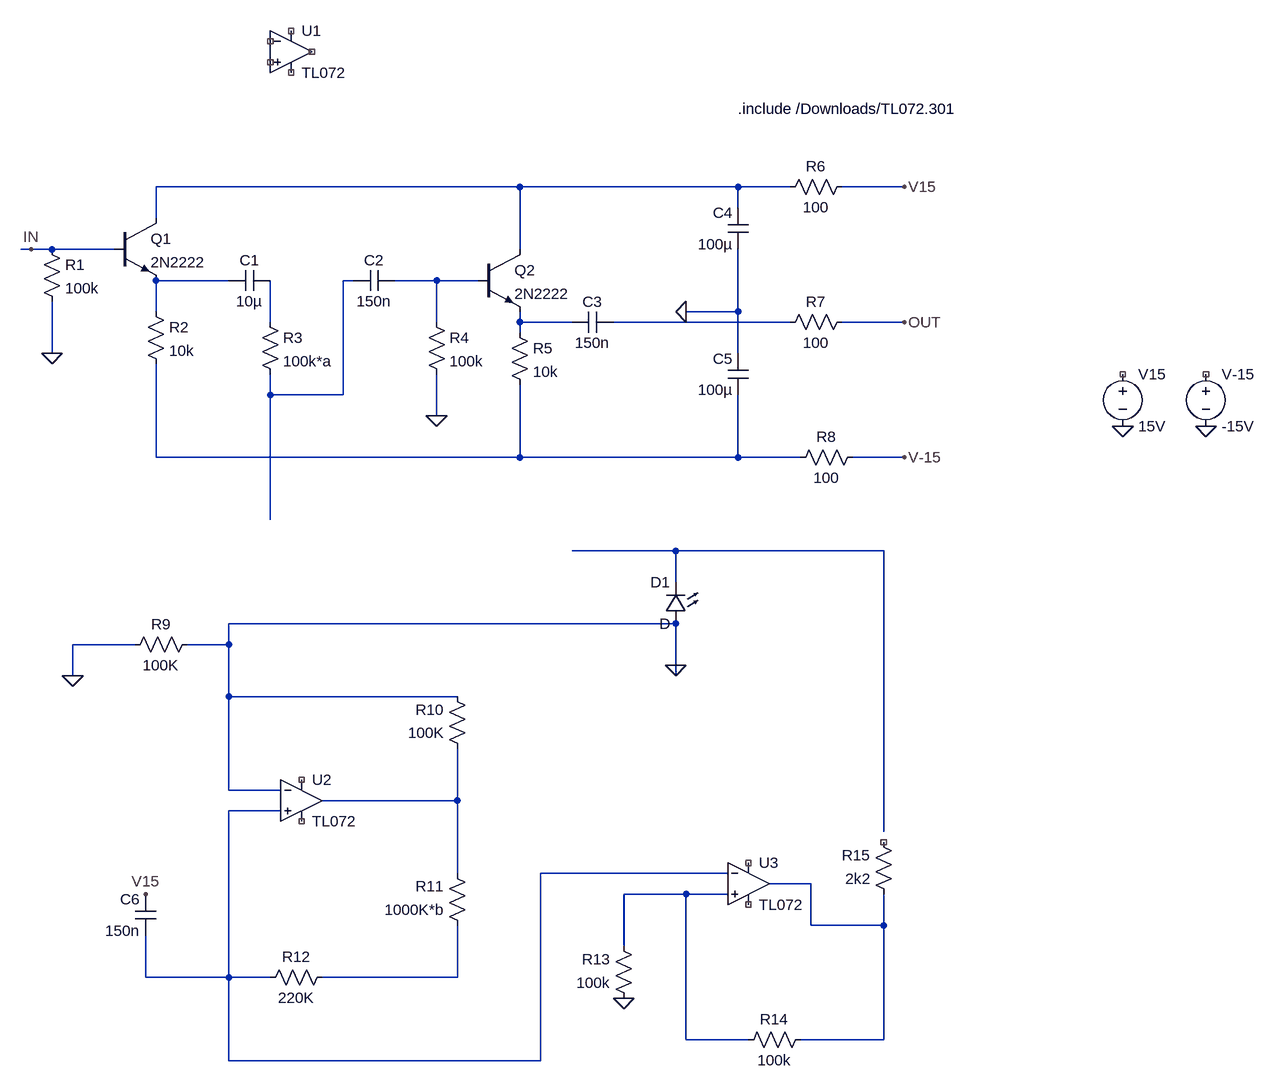
[diagram p0: schematic AM.asc]
AM.asc, the LTspice schematic file:
Version 4
SHEET 1 1952 1544
WIRE 816 192 256 192
WIRE 1152 192 816 192
WIRE 1232 192 1152 192
WIRE 1408 192 1312 192
WIRE 1152 224 1152 192
WIRE 256 240 256 192
WIRE 64 288 48 288
WIRE 96 288 64 288
WIRE 192 288 96 288
WIRE 816 288 816 192
WIRE 368 336 256 336
WIRE 560 336 544 336
WIRE 688 336 624 336
WIRE 752 336 688 336
WIRE 256 384 256 336
WIRE 1152 384 1152 288
WIRE 1152 384 1072 384
WIRE 432 400 432 336
WIRE 688 400 688 336
WIRE 816 400 816 384
WIRE 896 400 816 400
WIRE 1232 400 960 400
WIRE 1408 400 1312 400
WIRE 816 416 816 400
WIRE 96 448 96 368
WIRE 1152 448 1152 384
WIRE 432 512 432 480
WIRE 544 512 544 336
WIRE 544 512 432 512
WIRE 688 544 688 480
WIRE 256 608 256 464
WIRE 816 608 816 496
WIRE 816 608 256 608
WIRE 1152 608 1152 512
WIRE 1152 608 816 608
WIRE 1248 608 1152 608
WIRE 1408 608 1328 608
WIRE 432 704 432 512
WIRE 1056 752 896 752
WIRE 1376 752 1056 752
WIRE 1056 800 1056 752
WIRE 1056 864 368 864
WIRE 224 896 128 896
WIRE 368 896 368 864
WIRE 368 896 304 896
WIRE 1056 928 1056 864
WIRE 128 944 128 896
WIRE 1056 944 1056 928
WIRE 368 976 368 896
WIRE 720 976 368 976
WIRE 368 1120 368 976
WIRE 448 1120 368 1120
WIRE 720 1136 720 1056
WIRE 720 1136 512 1136
WIRE 448 1152 368 1152
WIRE 1376 1184 1376 752
WIRE 720 1248 720 1136
WIRE 1136 1248 848 1248
WIRE 1264 1264 1200 1264
WIRE 1072 1280 976 1280
WIRE 1136 1280 1072 1280
WIRE 1264 1328 1264 1264
WIRE 1376 1328 1376 1280
WIRE 1376 1328 1264 1328
WIRE 976 1360 976 1280
WIRE 240 1408 240 1344
WIRE 368 1408 368 1152
WIRE 368 1408 240 1408
WIRE 432 1408 368 1408
WIRE 720 1408 720 1328
WIRE 720 1408 512 1408
WIRE 1072 1504 1072 1280
WIRE 1168 1504 1072 1504
WIRE 1376 1504 1376 1328
WIRE 1376 1504 1248 1504
WIRE 368 1536 368 1408
WIRE 848 1536 848 1248
WIRE 848 1536 368 1536
FLAG 64 288 IN
FLAG 96 448 0
FLAG 688 544 0
FLAG 1072 384 0
FLAG 1408 192 V15
FLAG 1408 400 OUT
FLAG 1408 608 V-15
FLAG 128 944 0
FLAG 240 1280 V15
FLAG 1056 928 0
FLAG 976 1440 0
FLAG 1744 560 0
FLAG 1872 560 0
SYMBOL res 80 272 R0
SYMATTR InstName R1
SYMATTR Value 100k
SYMBOL npn 192 240 R0
SYMATTR InstName Q1
SYMATTR Value 2N2222
SYMBOL res 240 368 R0
SYMATTR InstName R2
SYMATTR Value 10k
SYMBOL cap 432 320 R90
WINDOW 0 0 32 VBottom 2
WINDOW 3 32 32 VTop 2
SYMATTR InstName C1
SYMATTR Value 10µ
SYMBOL res 416 384 R0
SYMATTR InstName R3
SYMATTR Value 100k*a
SYMBOL cap 624 320 R90
WINDOW 0 0 32 VBottom 2
WINDOW 3 32 32 VTop 2
SYMATTR InstName C2
SYMATTR Value 150n
SYMBOL res 672 384 R0
SYMATTR InstName R4
SYMATTR Value 100k
SYMBOL npn 752 288 R0
SYMATTR InstName Q2
SYMATTR Value 2N2222
SYMBOL res 800 400 R0
SYMATTR InstName R5
SYMATTR Value 10k
SYMBOL cap 960 384 R90
WINDOW 0 0 32 VBottom 2
WINDOW 3 32 32 VTop 2
SYMATTR InstName C3
SYMATTR Value 150n
SYMBOL cap 1168 288 R180
WINDOW 0 24 56 Left 2
WINDOW 3 24 8 Left 2
SYMATTR InstName C4
SYMATTR Value 100µ
SYMBOL cap 1168 512 R180
WINDOW 0 24 56 Left 2
WINDOW 3 24 8 Left 2
SYMATTR InstName C5
SYMATTR Value 100µ
SYMBOL res 1328 176 R90
WINDOW 0 0 56 VBottom 2
WINDOW 3 32 56 VTop 2
SYMATTR InstName R6
SYMATTR Value 100
SYMBOL res 1328 384 R90
WINDOW 0 0 56 VBottom 2
WINDOW 3 32 56 VTop 2
SYMATTR InstName R7
SYMATTR Value 100
SYMBOL res 1344 592 R90
WINDOW 0 0 56 VBottom 2
WINDOW 3 32 56 VTop 2
SYMATTR InstName R8
SYMATTR Value 100
SYMBOL Opamps/opamp2 464 -80 R0
SYMATTR InstName U1
SYMATTR Value TL072
SYMBOL res 320 880 R90
WINDOW 0 0 56 VBottom 2
WINDOW 3 32 56 VTop 2
SYMATTR InstName R9
SYMATTR Value 100K
SYMBOL res 736 1072 R180
WINDOW 0 36 76 Left 2
WINDOW 3 36 40 Left 2
SYMATTR InstName R10
SYMATTR Value 100K
SYMBOL res 736 1344 R180
WINDOW 0 36 76 Left 2
WINDOW 3 36 40 Left 2
SYMATTR InstName R11
SYMATTR Value 1000K*b
SYMBOL res 416 1424 R270
WINDOW 0 32 56 VTop 2
WINDOW 3 0 56 VBottom 2
SYMATTR InstName R12
SYMATTR Value 220K
SYMBOL res 992 1456 R180
WINDOW 0 36 76 Left 2
WINDOW 3 36 40 Left 2
SYMATTR InstName R13
SYMATTR Value 100k
SYMBOL res 1152 1520 R270
WINDOW 0 32 56 VTop 2
WINDOW 3 0 56 VBottom 2
SYMATTR InstName R14
SYMATTR Value 100k
SYMBOL res 1392 1296 R180
WINDOW 0 36 76 Left 2
WINDOW 3 36 40 Left 2
SYMATTR InstName R15
SYMATTR Value 2k2
SYMBOL cap 256 1344 R180
WINDOW 0 24 56 Left 2
WINDOW 3 24 8 Left 2
SYMATTR InstName C6
SYMATTR Value 150n
SYMBOL Opamps/opamp2 480 1072 R0
SYMATTR InstName U2
SYMATTR Value TL072
SYMBOL Opamps/opamp2 1168 1200 R0
SYMATTR InstName U3
SYMATTR Value TL072
SYMBOL LED 1072 864 R180
WINDOW 0 24 64 Left 2
WINDOW 3 24 0 Left 2
SYMATTR InstName D1
SYMBOL voltage 1744 464 R0
SYMATTR InstName V15
SYMATTR Value 15V
SYMBOL voltage 1872 464 R0
SYMATTR InstName V-15
SYMATTR Value -15V
TEXT 1152 72 Left 2 !.include /Downloads/TL072.301

The netlist it stands for:
* AM.asc
R1 IN 0 100k
Q1 N001 IN N002 0 2N2222
R2 N002 N008 10k
C1 N005 N002 10µ
R3 N005 N003 100k*a
C2 N004 N003 150n
R4 N004 0 100k
Q2 N001 N004 N006 0 2N2222
R5 N006 N008 10k
C3 N007 N006 150n
C4 0 N001 100µ
C5 N008 0 100µ
R6 V15 N001 100
R7 OUT N007 100
R8 V-15 N008 100
XU1 NC_01 NC_02 NC_03 NC_04 NC_05 TL072  ; pins In+ In- V+ V- OUT
R9 0 0 100K
R10 N010 0 100K
R11 N014 N010 1000K*b
R12 N011 N014 220K
R13 0 N013 100k
R14 N013 N012 100k
R15 N012 NC_06 2k2
C6 N011 V15 150n
XU2 N011 0 NC_07 NC_08 N010 TL072  ; pins In+ In- V+ V- OUT
XU3 N013 N011 NC_09 NC_10 N012 TL072  ; pins In+ In- V+ V- OUT
D1 0 N009 D
V15 NC_11 0 15V
V-15 NC_12 0 -15V
.model D D
.lib standard.dio
.model NPN NPN
.model PNP PNP
.lib standard.bjt
.include /Downloads/TL072.301
.backanno
.end